# EAGLE schematic D1MSHO (EAGLE 8.4.3)
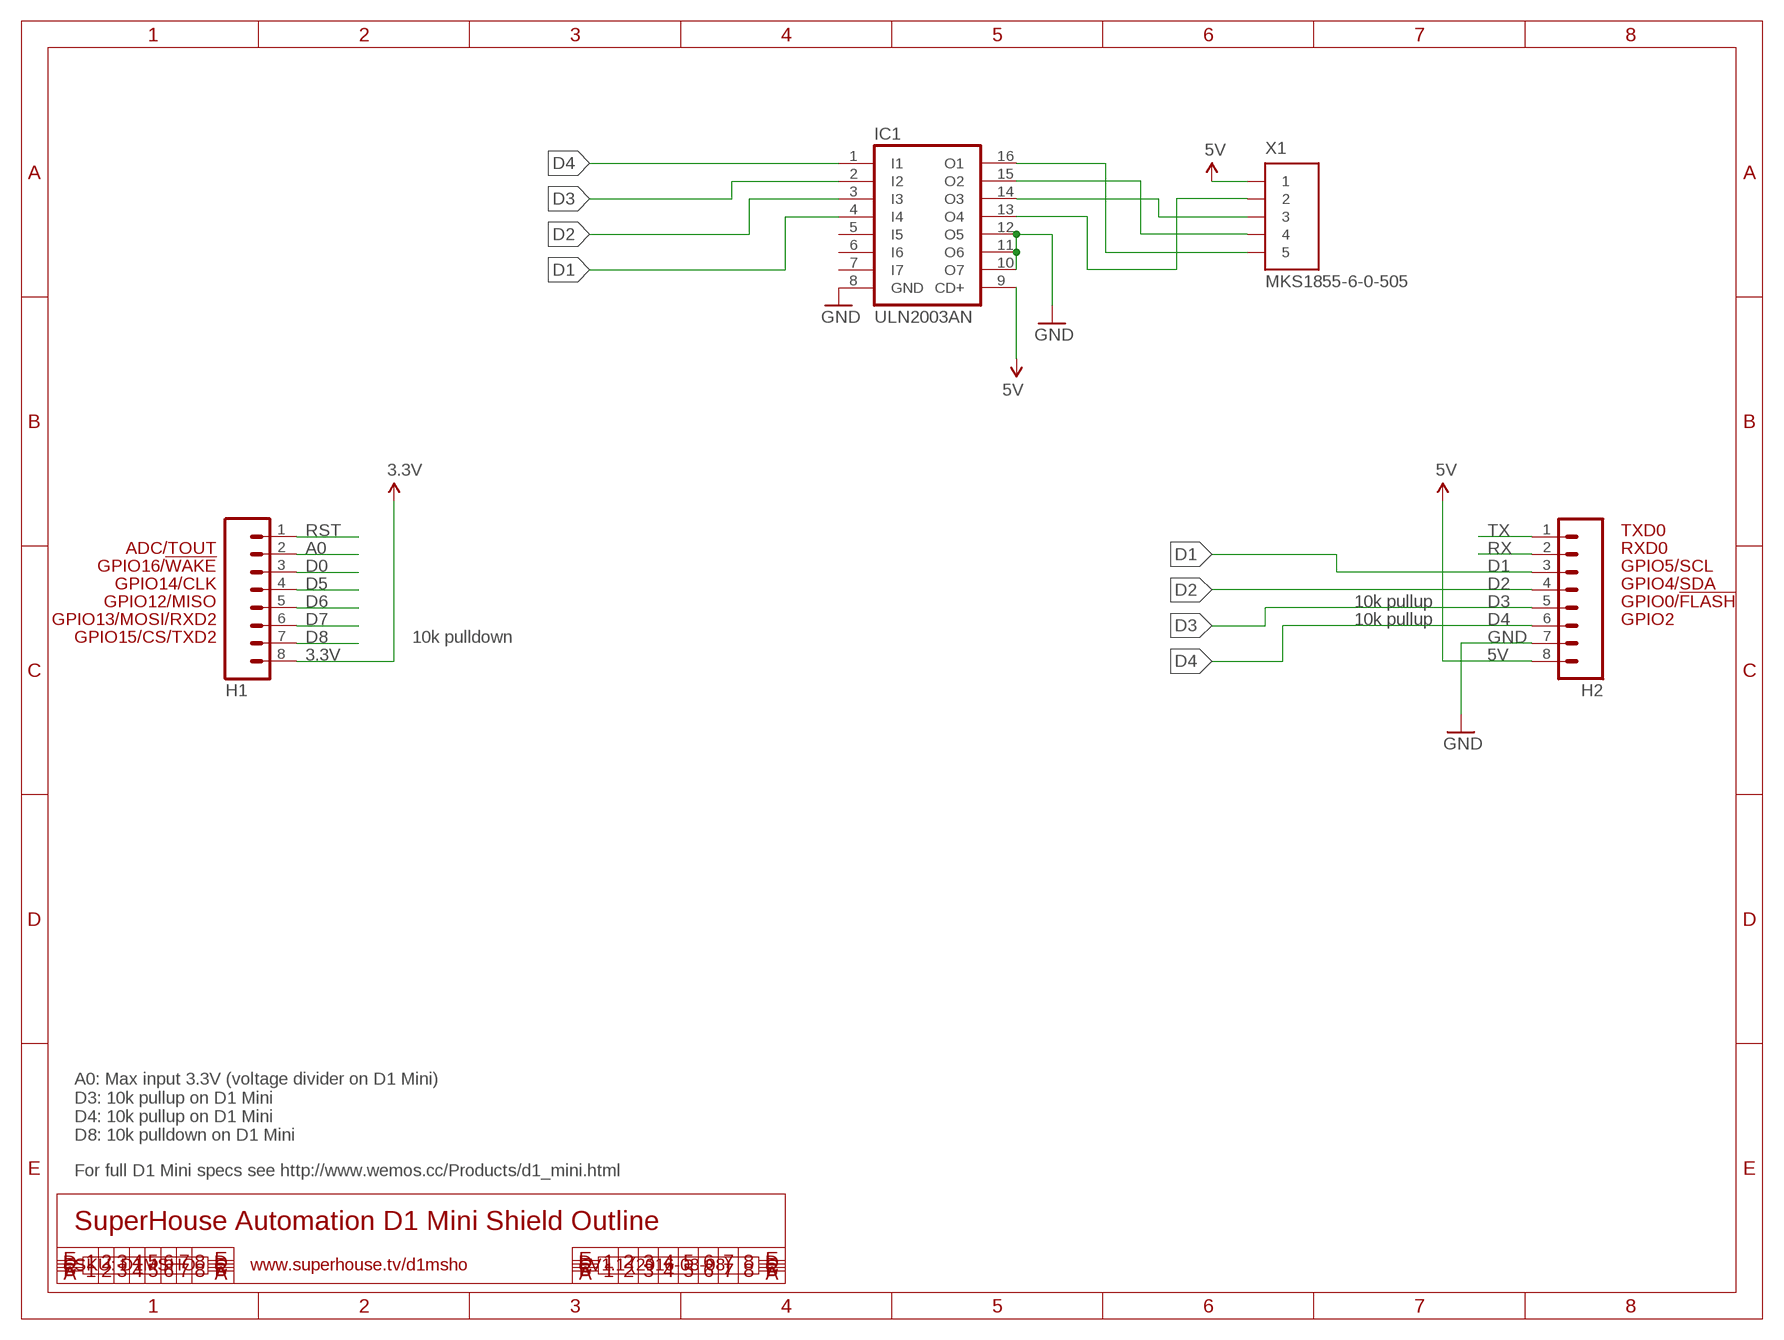
[diagram p0: schematic, sheet 1]

## Parts
H1  M08  [1X08]
H2  M08  [1X08]
IC1  ULN2003AN  [DIL16]
X1  MKS1855-6-0-505  [MKS1855-6-0-505]

## Nets
3.3V: H1.8
5V: H2.8 IC1.9(CD+) X1.1
A0: H1.2
D0: H1.3
D1: H2.3 IC1.4(I4)
D2: H2.4 IC1.3(I3)
D3: H2.5 IC1.2(I2)
D4: H2.6
D5: H1.4
D6: H1.5
D7: H1.6
D8: H1.7
GND: H2.7 IC1.8(GND) IC1.10(O7) IC1.11(O6) IC1.12(O5)
N$5: IC1.16(O1) X1.5
N$6: IC1.15(O2) X1.4
N$7: IC1.14(O3) X1.3
N$8: IC1.13(O4) X1.2
RST: H1.1
RX: H2.2
TX: H2.1
Unconnected: IC1.1(I1) IC1.5(I5) IC1.6(I6) IC1.7(I7)

## Notes on the sheet
- TXD0
- ADC/TOUT | RXD0
- GPIO16/!WAKE | GPIO5/SCL
- GPIO14/CLK | GPIO4/SDA
- GPIO12/MISO | 10k pullup | GPIO0/!FLASH
- GPIO13/MOSI/RXD2 | 10k pullup | GPIO2
- GPIO15/CS/TXD2 | 10k pulldown
- A0: Max input 3.3V (voltage divider on D1 Mini)
  D3: 10k pullup on D1 Mini
  D4: 10k pullup on D1 Mini
  D8: 10k pulldown on D1 Mini
- For full D1 Mini specs see http://www.wemos.cc/Products/d1_mini.html
- SuperHouse Automation D1 Mini Shield Outline
- SKU: D1MSHO | www.superhouse.tv/d1msho | V1.1 (2016-03-08)

## Library data of the parts
H1 H2 = freetronics-original:M08: Header 8 Standard 8-pin 0.1" header. Use with straight break away headers (SKU : PRT-00116), right angle break away headers (PRT-00553), swiss pins (PRT-00743), machine pins (PRT-00117), and female headers (PRT-00115).
IC1 = uln-udn:ULN2003A: DRIVER ARRAY
X1 = con-stocko:MKS1855-6-0-505: Serie MKS 1850 Lötstifte In-line, Raster 2.5 mm, Stiftwannen, stehend, mit Rastlasche Source: http://www.stocko.de/de/index.php?seite=ka_rfk2_mks1850.html&rubrik=Katalog+-+RFK+2 rfk_1850.pdf; OC_FARNELL: 1134508; OC_NEWARK: unknown

## Net classes
0 default: width 0.305 mm, drill 0.508 mm, clearance 0.254 mm
1 power: width 0.203 mm, clearance 0.152 mm